# EAGLE schematic MDM_V3_ControlBoard_B (EAGLE 6.4)
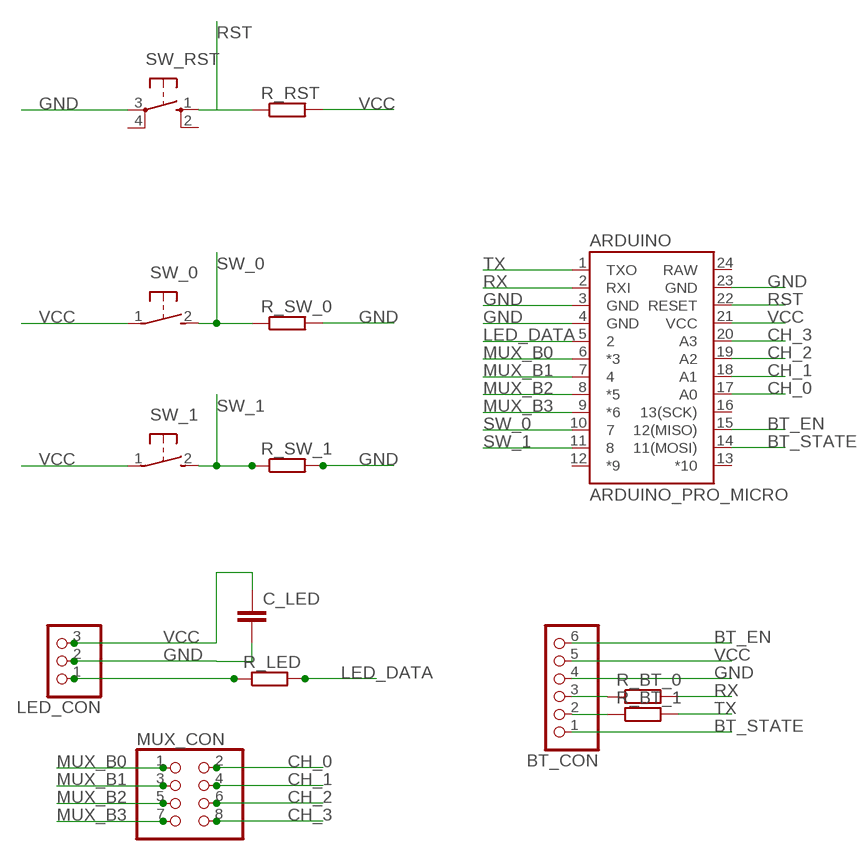
[diagram p0: schematic, sheet 1]

## Parts
ARDUINO  ARDUINO_PRO_MICRO  [ARDUINO_PRO_MICRO]
BT_CON  PINHD-1X6  [1X06]
C_LED  C-EUC1206K  [C1206K]
LED_CON  PINHD-1X3  [1X03]
MUX_CON  PINHD-2X4  [2X04]
R_BT_0  R-EU_M1206  [M1206]
R_BT_1  R-EU_M1206  [M1206]
R_LED  R-EU_M1206  [M1206]
R_RST  R-EU_M1206  [M1206]
R_SW_0  R-EU_M1206  [M1206]
R_SW_1  R-EU_M1206  [M1206]
SW_0  31-XX  [B3F-31XX]
SW_1  31-XX  [B3F-31XX]
SW_RST  10-XX  [B3F-10XX]

## Nets
BT_EN: ARDUINO.15(12(MISO)) BT_CON.6
BT_STATE: ARDUINO.14(11(MOSI)) BT_CON.1
CH_0: ARDUINO.17(A0) MUX_CON.2
CH_1: ARDUINO.18(A1) MUX_CON.4
CH_2: ARDUINO.19(A2) MUX_CON.6
CH_3: ARDUINO.20(A3) MUX_CON.8
GND [GND]: ARDUINO.3(GND) ARDUINO.4(GND) ARDUINO.23(GND) BT_CON.4 C_LED.2 LED_CON.2 R_SW_0.2 R_SW_1.2 SW_RST.3(P)
LED_DATA: ARDUINO.5 R_LED.2
MUX_B0: ARDUINO.6(*3) MUX_CON.1
MUX_B1: ARDUINO.7 MUX_CON.3
MUX_B2: ARDUINO.8(*5) MUX_CON.5
MUX_B3: ARDUINO.9(*6) MUX_CON.7
N$9: BT_CON.2 R_BT_1.1
N$10: BT_CON.3 R_BT_0.1
N$12: LED_CON.1 R_LED.1
RST: ARDUINO.22(RESET) R_RST.1 SW_RST.1(S)
RX: ARDUINO.2(RXI) R_BT_0.2
SW_0: ARDUINO.10 R_SW_0.1 SW_0.2(S)
SW_1: ARDUINO.11 R_SW_1.1 SW_1.2(S)
TX: ARDUINO.1(TXO) R_BT_1.2
VCC [GND]: ARDUINO.21(VCC) BT_CON.5 C_LED.1 LED_CON.3 R_RST.2 SW_0.1(P) SW_1.1(P)
Unconnected: ARDUINO.12(*9) ARDUINO.13(*10) ARDUINO.16(13(SCK)) ARDUINO.24(RAW) SW_RST.2(S1) SW_RST.4(P1)

## Library data of the parts
ARDUINO = SparkFun-Boards:ARDUINO_PRO_MICRO
BT_CON = pinhead:PINHD-1X6: PIN HEADER
C_LED = resistor:C-EU: CAPACITOR, European symbol
LED_CON = adafruit:PINHD-1X3: PIN HEADER
MUX_CON = pinhead:PINHD-2X4: PIN HEADER
R_BT_0 R_BT_1 R_LED R_RST R_SW_0 R_SW_1 = resistor:R-EU_: RESISTOR, European symbol
SW_0 SW_1 = switch-omron:31-XX: OMRON SWITCH; MPN: B3F-3100; OC_FARNELL: 959704; OC_NEWARK: 36M3582
SW_RST = switch-omron:10-XX: OMRON SWITCH; MPN: B3F-1000; OC_FARNELL: 176432; OC_NEWARK: 36M3542

## Net classes
0 default: width 0.635 mm
1 GND: width 1.016 mm, clearance 0.254 mm